# Altium project ICAN-7006-STM.PrjPCB
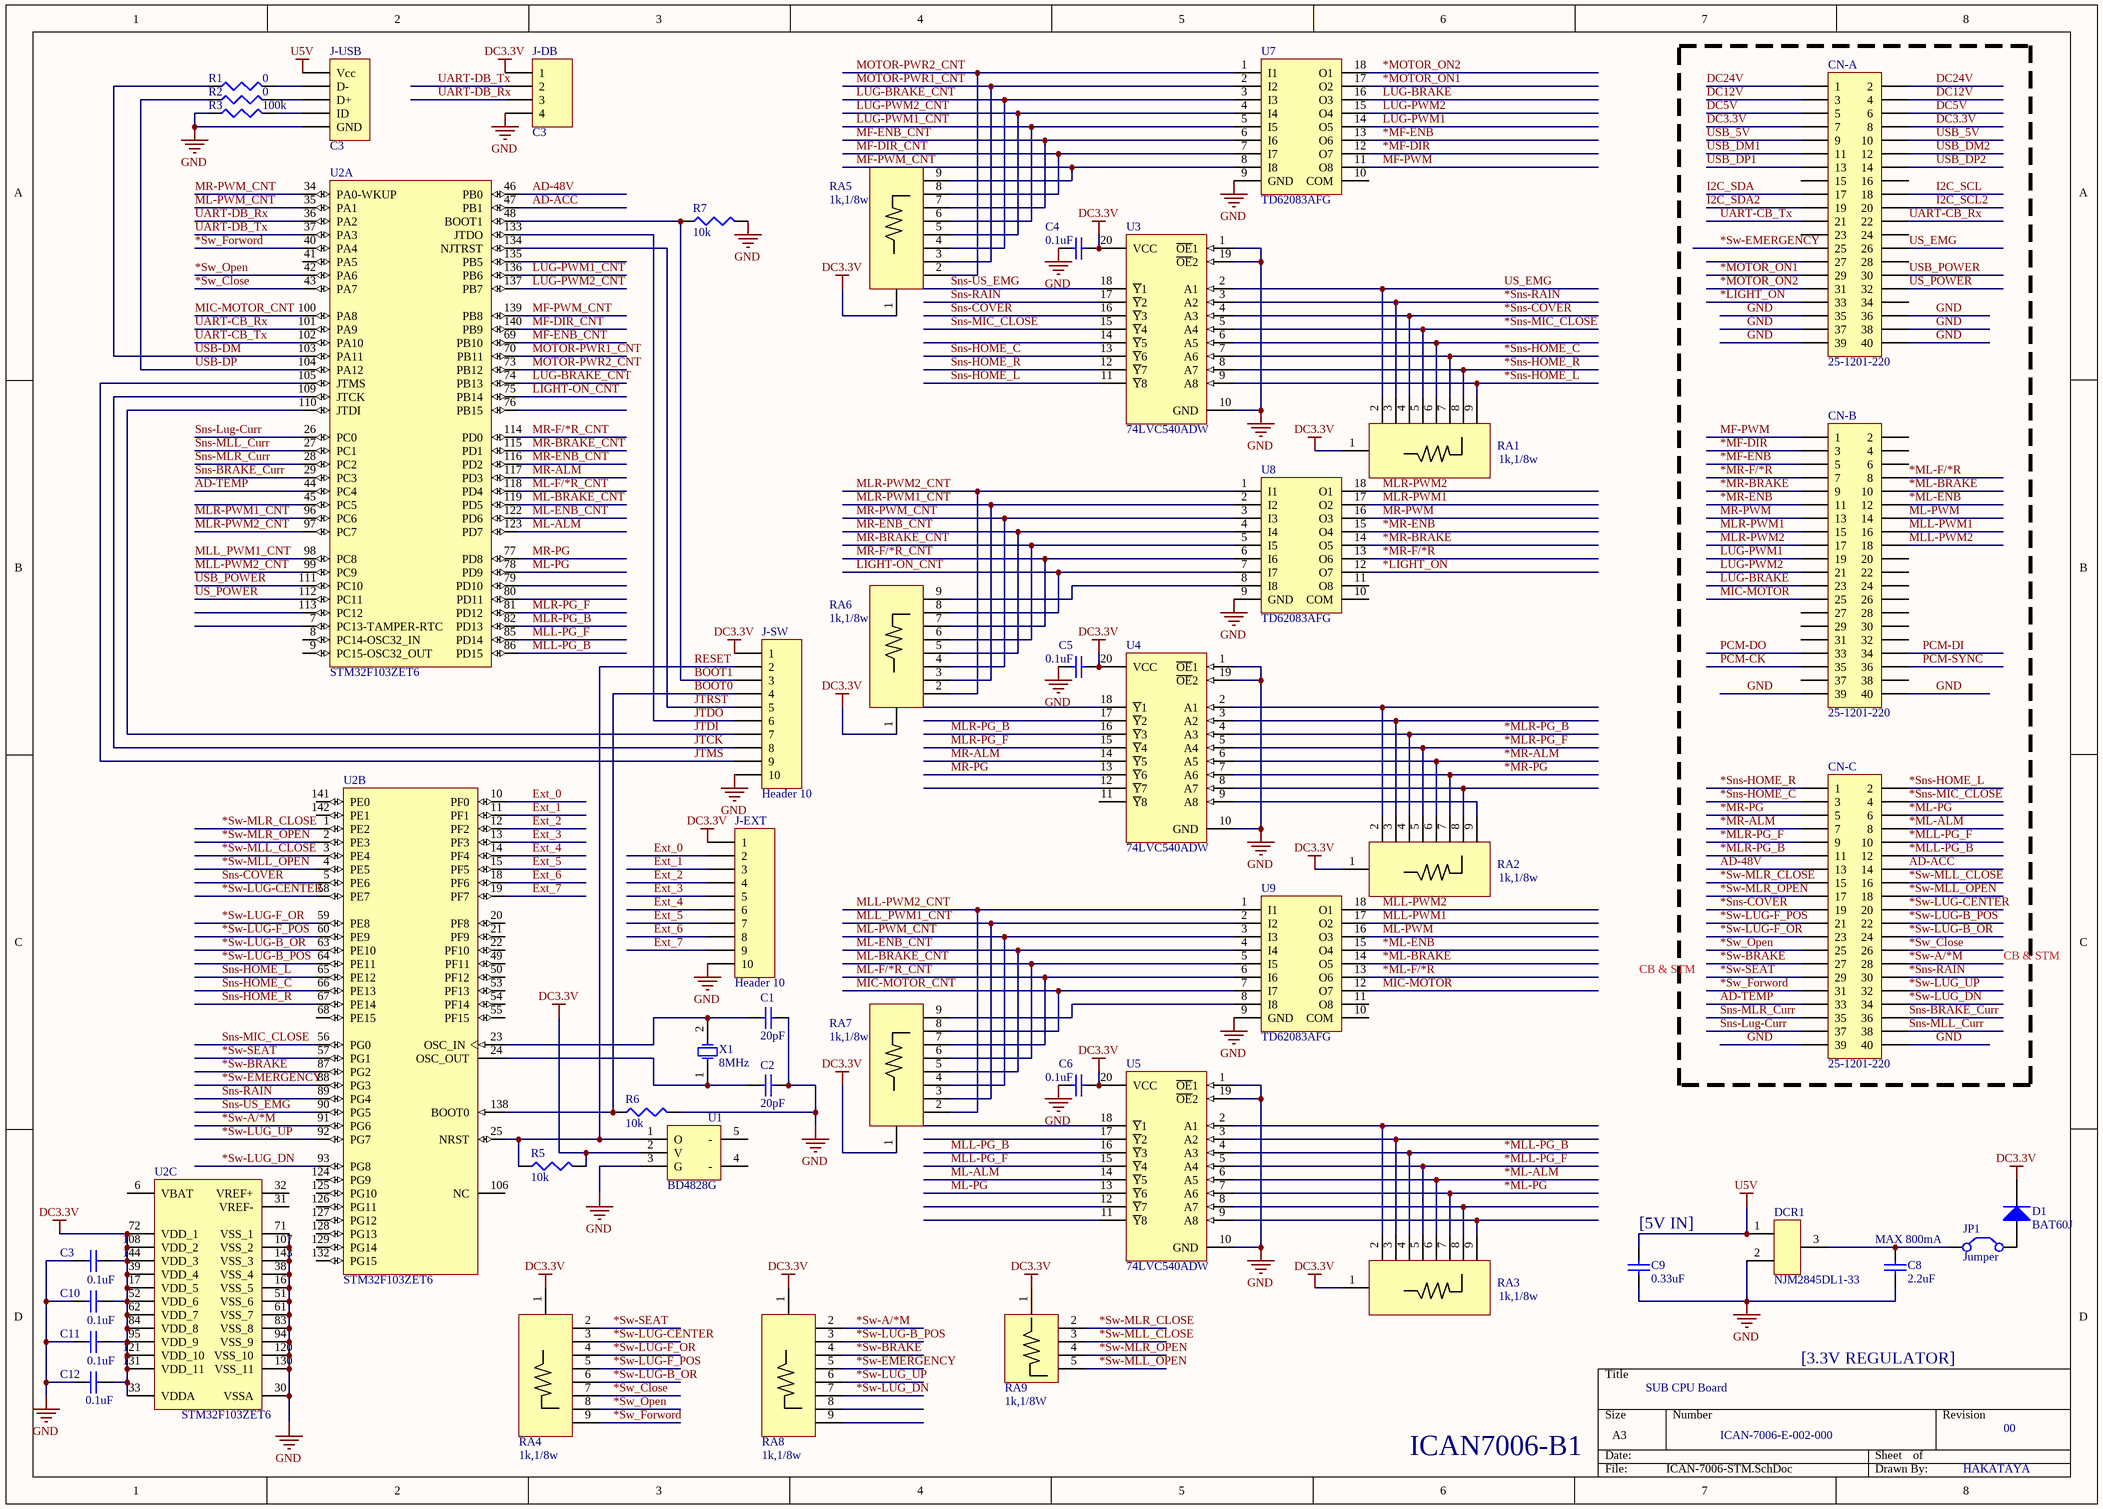
[diagram p0: ICAN-7006-STM.SchDoc]
1 sheet, 45 parts. Net scope: global (net labels, ports and power ports of the same name join across sheets).
Board file: ICAN-7006-STM.PcbDoc

## Sheet ICAN-7006-STM.SchDoc
size A3; PageSetup: Record=PageOptions|CenterHorizontal=True|CenterVertical=True|PrintScale=1.04|XCorrection=1.00|YCorrection=1.00|PrintKind=0|BorderSize=5000000|LeftOffset=0|BottomOffset=0|Orientation=2|PaperLength=1000|PaperWidth=1000|Scale=100|PaperSource=7|PrintQuality=-4|MediaType=1|DitherType=10|PaperKind=A3|PrintScaleMode=1

### Parts
C1  20pF  [[0805]2012]
C2  20pF  [[0805]2012]
C3  0.1uF  [[0805]2012]
C4  0.1uF  [[0805]2012]
C5  0.1uF  [[0805]2012]
C6  0.1uF  [[0805]2012]
C8  2.2uF  [[0805]2012]
C9  0.33uF  [[0805]2012]
C10  0.1uF  [[0805]2012]
C11  0.1uF  [[0805]2012]
C12  0.1uF  [[0805]2012]
CN-A  25-1201-220  [HDR2X20]
CN-B  25-1201-220  [HDR2X20]
CN-C  25-1201-220  [HDR2X20]
D1  BAT60J  [[1107]2807 DIODE]
DCR1  NJM2845DL1-33  [TO-252-3]
J-DB  C3  [C3-S4]
J-EXT  Header 10  [HDR1X10]
J-SW  Header 10  [HDR1X10]
J-USB  C3  [C3-S5]
JP1  Jumper  [PIN2]
R1  0  [5025[2010]]
R2  0  [5025[2010]]
R3  100k  [5025[2010]]
R5  10k  [[0805]2012]
R6  10k  [[0805]2012]
R7  10k  [[0805]2012]
RA1  1k,1/8w  [SIP 9p]
RA2  1k,1/8w  [SIP 9p]
RA3  1k,1/8w  [SIP 9p]
RA4  1k,1/8w  [SIP 9p]
RA5  1k,1/8w  [SIP 9p]
RA6  1k,1/8w  [SIP 9p]
RA7  1k,1/8w  [SIP 9p]
RA8  1k,1/8w  [SIP 9p]
RA9  1k,1/8W  [SIP 5P]
U1  BD4828G  [PST596]
U2  STM32F103ZET6  [STM-LQFP144_L]  (parts A,B,C of 3)
U3  74LVC540ADW  [SO-20]
U4  74LVC540ADW  [SO-20]
U5  74LVC540ADW  [SO-20]
U7  TD62083AFG  [TD6208X(SOP)]
U8  TD62083AFG  [TD6208X(SOP)]
U9  TD62083AFG  [TD6208X(SOP)]
X1  8MHz  [CRYSTAL 49S]

### Blocks framed on the sheet
CB & STM: CN-A CN-B CN-C

### Nets
DC3.3V: C3.2 C4.2 C5.2 C6.2 C10.2 C11.2 C12.2 CN-A.7 CN-A.8 D1.1(A) J-DB.1 J-EXT.1 J-SW.1 R5.2 RA1.1 RA2.1 RA3.1 RA4.1 RA5.1 RA6.1 RA7.1 RA8.1 RA9.1 U1.2(V) U2.17(VDD_5) U2.33(VDDA) U2.39(VDD_4) U2.52(VDD_6) U2.62(VDD_7) U2.72(VDD_1) U2.84(VDD_8) U2.95(VDD_9) U2.108(VDD_2) U2.121(VDD_10) U2.131(VDD_11) U2.144(VDD_3) U3.20(VCC) U4.20(VCC) U5.20(VCC)
GND: C1.2 C2.2 C3.1 C4.1 C5.1 C6.1 C8.1 C9.1 C10.1 C11.1 C12.1 CN-A.35 CN-A.36 CN-A.37 CN-A.38 CN-A.39 CN-A.40 CN-B.39 CN-B.40 CN-C.39 CN-C.40 DCR1.2 J-DB.4 J-EXT.10 J-SW.10 J-USB.5(GND) R3.1 R6.2 R7.2 U1.3(G) U2.16(VSS_5) U2.30(VSSA) U2.38(VSS_4) U2.51(VSS_6) U2.61(VSS_7) U2.71(VSS_1) U2.83(VSS_8) U2.94(VSS_9) U2.107(VSS_2) U2.120(VSS_10) U2.130(VSS_11) U2.143(VSS_3) U3.1(~{OE}1) U3.10(GND) U3.19(~{OE}2) U4.1(~{OE}1) U4.10(GND) U4.19(~{OE}2) U5.1(~{OE}1) U5.10(GND) U5.19(~{OE}2) U7.9(GND) U8.9(GND) U9.9(GND)
U5V: C9.2 DCR1.1 J-USB.1(Vcc)
*LIGHT_ON: CN-A.33 U8.12(O7)
*MF-DIR: CN-B.3 U7.12(O7)
*MF-ENB: CN-B.5 U7.13(O6)
*ML-ALM: CN-C.8 RA3.6 U5.6(A5)
*ML-BRAKE: CN-B.10 U9.14(O5)
*ML-ENB: CN-B.12 U9.15(O4)
*ML-F/*R: CN-B.8 U9.13(O6)
*ML-PG: CN-C.6 RA3.7 U5.7(A6)
*MLL-PG_B: CN-C.12 RA3.4 U5.4(A3)
*MLL-PG_F: CN-C.10 RA3.5 U5.5(A4)
*MLR-PG_B: CN-C.11 RA2.4 U4.4(A3)
*MLR-PG_F: CN-C.9 RA2.5 U4.5(A4)
*MOTOR_ON1: CN-A.29 U7.17(O2)
*MOTOR_ON2: CN-A.31 U7.18(O1)
*MR-ALM: CN-C.7 RA2.6 U4.6(A5)
*MR-BRAKE: CN-B.9 U8.14(O5)
*MR-ENB: CN-B.11 U8.15(O4)
*MR-F/*R: CN-B.7 U8.13(O6)
*MR-PG: CN-C.5 RA2.7 U4.7(A6)
*Sns-COVER: CN-C.19 RA1.4 U3.4(A3)
*Sns-HOME_C: CN-C.3 RA1.7 U3.7(A6)
*Sns-HOME_L: CN-C.2 RA1.9 U3.9(A8)
*Sns-HOME_R: CN-C.1 RA1.8 U3.8(A7)
*Sns-MIC_CLOSE: CN-C.4 RA1.5 U3.5(A4)
*Sns-RAIN: CN-C.30 RA1.3 U3.3(A2)
*Sw-A/*M: CN-C.28 RA8.2 U2.91(PG6)
*Sw-BRAKE: CN-C.27 RA8.4 U2.87(PG2)
*Sw-EMERGENCY: CN-A.25 RA8.5 U2.88(PG3)
*Sw-LUG-B_OR: CN-C.24 RA4.6 U2.63(PE10)
*Sw-LUG-B_POS: CN-C.22 RA8.3 U2.64(PE11)
*Sw-LUG-CENTER: CN-C.20 RA4.3 U2.58(PE7)
*Sw-LUG-F_OR: CN-C.23 RA4.4 U2.59(PE8)
*Sw-LUG-F_POS: CN-C.21 RA4.5 U2.60(PE9)
*Sw-LUG_DN: CN-C.34 RA8.7 U2.93(PG8)
*Sw-LUG_UP: CN-C.32 RA8.6 U2.92(PG7)
*Sw-MLL_CLOSE: CN-C.16 RA9.3 U2.3(PE4)
*Sw-MLL_OPEN: CN-C.18 RA9.5 U2.4(PE5)
*Sw-MLR_CLOSE: CN-C.15 RA9.2 U2.1(PE2)
*Sw-MLR_OPEN: CN-C.17 RA9.4 U2.2(PE3)
*Sw-SEAT: CN-C.29 RA4.2 U2.57(PG1)
*Sw_Close: CN-C.26 RA4.7 U2.43(PA7)
*Sw_Forword: CN-C.31 RA4.9 U2.40(PA4)
*Sw_Open: CN-C.25 RA4.8 U2.42(PA6)
AD-48V: CN-C.13 U2.46(PB0)
AD-ACC: CN-C.14 U2.47(PB1)
AD-TEMP: CN-C.33 U2.44(PC4)
BOOT0: J-SW.4 R6.1 U2.138(BOOT0)
BOOT1: J-SW.3 R7.1 U2.48(BOOT1)
DC5V: CN-A.5 CN-A.6
DC12V: CN-A.3 CN-A.4
DC24V: CN-A.1 CN-A.2
Ext_0: J-EXT.2 U2.10(PF0)
Ext_1: J-EXT.3 U2.11(PF1)
Ext_2: J-EXT.4 U2.12(PF2)
Ext_3: J-EXT.5 U2.13(PF3)
Ext_4: J-EXT.6 U2.14(PF4)
Ext_5: J-EXT.7 U2.15(PF5)
Ext_6: J-EXT.8 U2.18(PF6)
Ext_7: J-EXT.9 U2.19(PF7)
I2C_SCL: CN-A.18
I2C_SCL2: CN-A.20
I2C_SDA: CN-A.17
I2C_SDA2: CN-A.19
JTCK: J-SW.8 U2.109(JTCK)
JTDI: J-SW.7 U2.110(JTDI)
JTDO: J-SW.6 U2.133(JTDO)
JTMS: J-SW.9 U2.105(JTMS)
JTRST: J-SW.5 U2.134(NJTRST)
LIGHT-ON_CNT: RA6.8 U2.75(PB14) U8.7(I7)
LUG-BRAKE: CN-B.23 U7.16(O3)
LUG-BRAKE_CNT: RA5.4 U2.74(PB13) U7.3(I3)
LUG-PWM1: CN-B.19 U7.14(O5)
LUG-PWM1_CNT: RA5.6 U2.136(PB6) U7.5(I5)
LUG-PWM2: CN-B.21 U7.15(O4)
LUG-PWM2_CNT: RA5.5 U2.137(PB7) U7.4(I4)
MF-DIR_CNT: RA5.8 U2.140(PB9) U7.7(I7)
MF-ENB_CNT: RA5.7 U2.69(PB10) U7.6(I6)
MF-PWM: CN-B.1 U7.11(O8)
MF-PWM_CNT: RA5.9 U2.139(PB8) U7.8(I8)
MIC-MOTOR: CN-B.25 U9.12(O7)
MIC-MOTOR_CNT: RA7.8 U2.100(PA8) U9.7(I7)
ML-ALM: U2.123(PD7) U5.14(~{Y}5)
ML-BRAKE_CNT: RA7.6 U2.119(PD5) U9.5(I5)
ML-ENB_CNT: RA7.5 U2.122(PD6) U9.4(I4)
ML-F/*R_CNT: RA7.7 U2.118(PD4) U9.6(I6)
ML-PG: U2.78(PD9) U5.13(~{Y}6)
ML-PWM: CN-B.14 U9.16(O3)
ML-PWM_CNT: RA7.4 U2.35(PA1) U9.3(I3)
MLL-PG_B: U2.86(PD15) U5.16(~{Y}3)
MLL-PG_F: U2.85(PD14) U5.15(~{Y}4)
MLL-PWM1: CN-B.16 U9.17(O2)
MLL-PWM2: CN-B.18 U9.18(O1)
MLL-PWM2_CNT: RA7.2 U2.99(PC9) U9.1(I1)
MLL_PWM1_CNT: RA7.3 U2.98(PC8) U9.2(I2)
MLR-PG_B: U2.82(PD13) U4.16(~{Y}3)
MLR-PG_F: U2.81(PD12) U4.15(~{Y}4)
MLR-PWM1: CN-B.15 U8.17(O2)
MLR-PWM1_CNT: RA6.3 U2.96(PC6) U8.2(I2)
MLR-PWM2: CN-B.17 U8.18(O1)
MLR-PWM2_CNT: RA6.2 U2.97(PC7) U8.1(I1)
MOTOR-PWR1_CNT: RA5.3 U2.70(PB11) U7.2(I2)
MOTOR-PWR2_CNT: RA5.2 U2.73(PB12) U7.1(I1)
MR-ALM: U2.117(PD3) U4.14(~{Y}5)
MR-BRAKE_CNT: RA6.6 U2.115(PD1) U8.5(I5)
MR-ENB_CNT: RA6.5 U2.116(PD2) U8.4(I4)
MR-F/*R_CNT: RA6.7 U2.114(PD0) U8.6(I6)
MR-PG: U2.77(PD8) U4.13(~{Y}6)
MR-PWM: CN-B.13 U8.16(O3)
MR-PWM_CNT: RA6.4 U2.34(PA0-WKUP) U8.3(I3)
PCM-CK: CN-B.35
PCM-DI: CN-B.34
PCM-DO: CN-B.33
PCM-SYNC: CN-B.36
RESET: J-SW.2 R5.1 U1.1(O) U2.25(NRST)
Sns-BRAKE_Curr: CN-C.36 U2.29(PC3)
Sns-COVER: U2.5(PE6) U3.16(~{Y}3)
Sns-HOME_C: U2.66(PE13) U3.13(~{Y}6)
Sns-HOME_L: U2.65(PE12) U3.11(~{Y}8)
Sns-HOME_R: U2.67(PE14) U3.12(~{Y}7)
Sns-Lug-Curr: CN-C.37 U2.26(PC0)
Sns-MIC_CLOSE: U2.56(PG0) U3.15(~{Y}4)
Sns-MLL_Curr: CN-C.38 U2.27(PC1)
Sns-MLR_Curr: CN-C.35 U2.28(PC2)
Sns-RAIN: U2.89(PG4) U3.17(~{Y}2)
Sns-US_EMG: U2.90(PG5) U3.18(~{Y}1)
UART-CB_Rx: CN-A.22 U2.101(PA9)
UART-CB_Tx: CN-A.21 U2.102(PA10)
UART-DB_Rx: J-DB.3 U2.36(PA2)
UART-DB_Tx: J-DB.2 U2.37(PA3)
US_EMG: CN-A.26 RA1.2 U3.2(A1)
US_POWER: CN-A.32 U2.112(PC11)
USB-DM: R1.1 U2.103(PA11)
USB-DP: R2.1 U2.104(PA12)
USB_5V: CN-A.9 CN-A.10
USB_DM1: CN-A.11
USB_DM2: CN-A.12
USB_DP1: CN-A.13
USB_DP2: CN-A.14
USB_POWER: CN-A.30 U2.111(PC10)
NetC1_1: C1.1 U2.23(OSC_IN) X1.2(OSC2)
NetC2_1: C2.1 U2.24(OSC_OUT) X1.1(OSC1)
NetC8_2: C8.2 DCR1.3 JP1.2(C2)
NetD1_2: D1.2(K) JP1.1(C1)
NetJ-USB_2: J-USB.2(D-) R1.2
NetJ-USB_3: J-USB.3(D+) R2.2
NetJ-USB_4: J-USB.4(ID) R3.2
NetRA1_6: RA1.6 U3.6(A5)
NetRA2_2: RA2.2 U4.2(A1)
NetRA2_3: RA2.3 U4.3(A2)
NetRA2_8: RA2.8 U4.8(A7)
NetRA2_9: RA2.9 U4.9(A8)
NetRA3_2: RA3.2 U5.2(A1)
NetRA3_3: RA3.3 U5.3(A2)
NetRA3_8: RA3.8 U5.8(A7)
NetRA3_9: RA3.9 U5.9(A8)
NetRA6_9: RA6.9 U8.8(I8)
NetRA7_9: RA7.9 U9.8(I8)

Not connected (* = marked no-connect by the designer): CN-A 15 16 23 24 27 28 34; CN-B 2 4 6 20 22 24 26 27 28 29 30 31 32 37 38; RA8 8 9; U1 4(-) 5(-); U2 6(VBAT) 7(PC13-TAMPER-RTC) 8(PC14-OSC32_IN) 9(PC15-OSC32_OUT) 20(PF8) 21(PF9) 22(PF10) 31(VREF-) 32(VREF+) 41(PA5) 45(PC5) 49(PF11) 50(PF12) 53(PF13) 54(PF14) 55(PF15) 68(PE15) 76(PB15) 79(PD10) 80(PD11) 106(NC) 113(PC12) 124(PG9) 125(PG10) 126(PG11) 127(PG12) 128(PG13) 129(PG14) 132(PG15) 135(PB5) 141(PE0) 142(PE1); U3 14(~{Y}5); U4 11(~{Y}8) 12(~{Y}7) 17(~{Y}2) 18(~{Y}1); U5 11(~{Y}8) 12(~{Y}7) 17(~{Y}2) 18(~{Y}1); U7 10(COM); U8 10(COM) 11(O8); U9 10(COM) 11(O8)

### Notes on the sheet
- CB & STM
- (near C9) [5V IN]
- (near C8) MAX 800mA
- SUB CPU Board
- [3.3V REGULATOR]
- ICAN7006-B1
- ICAN-7006-E-002-000
- 00
- HAKATAYA

### Library data of the parts
C1-C3 C8-C12 = Cap Semi: Capacitor; Published: 8-Jun-2000; LatestRevisionDate: 17-Jul-2002; LatestRevisionNote: Re-released for DXP Platform.; PackageReference: C1206; Publisher: Altium Limited
  C1 C2: Value: 20pF
  C3 C10-C12: Value: 0.1uF
  C8: Value: 2.2uF
  C9: Value: 0.33uF
C4-C6 = Cap: Capacitor; Published: 8-Jun-2000; LatestRevisionDate: 17-Jul-2002; LatestRevisionNote: Re-released for DXP Platform.; PackageReference: RAD-0.3; Publisher: Altium Limited; Value: 0.1uF
CN-A CN-B CN-C = Header 20X2: Header, 20-Pin, Dual row; LatestRevisionDate: 17-Jul-2002; LatestRevisionNote: Re-released for DXP Platform.; Publisher: Altium Limited; Supplier: Astron Corporation.; URL: http://www.astron.com.tw/product.php?idt=1&pid=68&pno=212; Supplier Part Number: 25-1201-220
D1 = Diode: Default Diode; Published: 8-Jun-2000; LatestRevisionDate: 17-Jul-2002; LatestRevisionNote: Re-released for DXP Platform.; PackageDocument: Sep-1996; PackageReference: SMC; Publisher: Altium Limited; Code_JEDEC: DO-214-AB; Supplier Part Number: BAT60J
DCR1 = IC3: REGURATOR; Supplier Part Number: NJM2845DL1-33
J-DB = Header 4: Header, 4-Pin; LatestRevisionDate: 17-Jul-2002; LatestRevisionNote: Re-released for DXP Platform.; Publisher: Altium Limited
J-EXT J-SW = Header 10: Header, 10-Pin; LatestRevisionDate: 17-Jul-2002; LatestRevisionNote: Re-released for DXP Platform.; Publisher: Altium Limited
J-USB = Header 5: Header, 5-Pin; LatestRevisionDate: 17-Jul-2002; LatestRevisionNote: Re-released for DXP Platform.; Publisher: Altium Limited
JP1 = Jumper: Jumper Wire; Published: 24-Mar-1999; LatestRevisionDate: 17-Jul-2002; LatestRevisionNote: Re-released for DXP Platform.; PackageReference: RAD-0.2; Publisher: Altium Limited
R1-R3 R5-R7 = Res3: Resistor; Published: 8-Jun-2000; LatestRevisionDate: 04-Mar-2005; LatestRevisionNote: PCB Footprint replaced.; PackageReference: J1-0603; Publisher: Altium Limited
  R1 R2: Value: 0; Supplier Part Number: MCR50
  R3: Value: 100k; Supplier Part Number: MCR50
  R5-R7: Value: 10k
RA1-RA8 = RES 8P: Resistor arrey; Value: 1k,1/8w
RA9 = RES 4P: Resistor arrey; Value: 1k,1/8w
U1 = IC5-WIDE: RESET IC; Supplier Part Number: BD4828G
U2 = STM32F103ZET6: ARM Cortex-M3 32-bit MCU, 512 KB Flash, 64 KB Internal RAM, 112 I/Os, 144-pin LQFP, -40 to 85 degC, Tray; A/D Converter: 3x12-bit (21 Channel); D/A Converter: 2x12-bit (2 Channel); FLASH Size (Prog) (kB): 512; I/Os (High Current): 112; Internal RAM Size (kB): 64; Operating Frequency(F) (Processor speed) (MHz): 72; Supply Voltage(Vcc) min (V): 2; DatasheetVersion: Rev. 8; PackageVersion: Rev. 4, 06/2013; PackageReference: LQFP144; PackageDescription: 144-Pin Low Profile Quad Flat Package, 20 x 20 mm Body, 0.5 mm Pitch; Supplier 1: Digi-Key; Supplier Part Number 1: 497-6442-ND; Supplier 2: Farnell; Supplier Part Number 2: 1624145; Supplier 3: Newark; Supplier Part Number 3: 57P1270; Supplier 4: Mouser; Supplier Part Number 4: 511-STM32F103ZET6; Core: ARM Cortex-M3; Packing: Tray; Mounting Technology: Surface Mount; PartNumber: STM32F103ZET6; ComponentLink1Description: Manufacturer URL; ComponentLink1URL: http://www.st.com/web/en/home.html; ComponentLink2Description: Datasheet; ComponentLink2URL: http://www.st.com/st-web-ui/static/active/en/resource/technical/document/datasheet/CD00191185.pdf; ComponentLink3Description: Package Specification; ComponentLink3URL: http://www.st.com/st-web-ui/static/active/en/resource/technical/document/datasheet/DM00037051.pdf
U3-U5 = SN74LS540N: Octal Buffer and Line Driver with 3-State Outputs; Published: 8-Jun-2000; LatestRevisionDate: 06-Jun-2005; LatestRevisionNote: Stylized 3D Model Added.; DatasheetVersion: Mar-1988; PackageVersion: Oct-1995; PackageReference: N020; Publisher: Altium Limited; PackageDescription: DIP; 20 Leads; Row Spacing 7.62 mm; Pitch 2.54 mm; ComponentLink1Description: Manufacturer Link; ComponentLink1URL: http://www.ti.com/; ComponentLink2Description: Datasheet; ComponentLink2URL: http://www-s.ti.com/sc/ds/sn74ls540.pdf; Supplier Part Number: 74LVC540ADW
U7-U9 = TD62083: Driver; Supplier Part Number: TD62083AFG
X1 = XTAL: Crystal Oscillator; Published: 8-Jun-2000; LatestRevisionDate: 17-Jul-2002; LatestRevisionNote: Re-released for DXP Platform.; PackageReference: R38; Publisher: Altium Limited; Value: 8MHz